# EAGLE design Scematic Kelompok 1 (EAGLE 9.6.2)
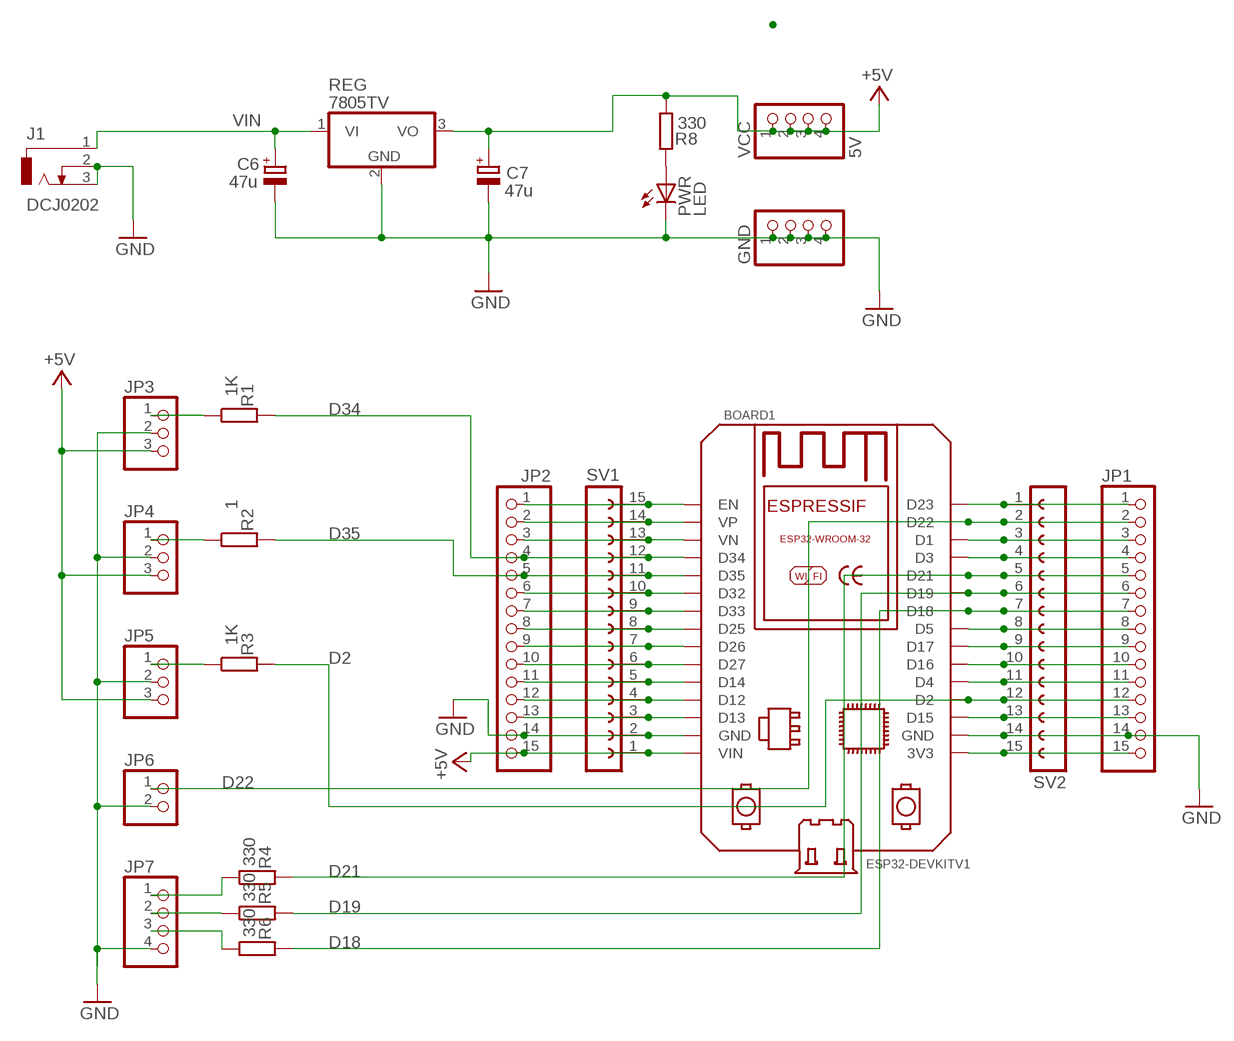
[diagram p0: schematic, sheet 1]

## Parts
BOARD1  ESP32DEVKITV1SHRIDATTDUDHAT  [ESP32-DEVKITV1]
C6  47u  CPOL-EUE2.5-5  [E2,5-5]
C7  47u  CPOL-EUE2.5-5  [E2,5-5]
GND  PINHD-1X4  [1X04]
J1  DCJ0202  [DCJ0202]
JP1  PINHD-1X15  [1X15]
JP2  PINHD-1X15  [1X15]
JP3  PINHD-1X3  [1X03]
JP4  PINHD-1X3  [1X03]
JP5  PINHD-1X3  [1X03]
JP6  PINHD-1X2  [1X02]
JP7  PINHD-1X4  [1X04]
PWR  LED  LED3MM  [LED3MM]
R1  1K  R-EU_0204/7  [0204/7]
R2  1  R-EU_0204/7  [0204/7]
R3  1K  R-EU_0204/7  [0204/7]
R4  330  R-EU_0204/7  [0204/7]
R5  330  R-EU_0204/7  [0204/7]
R6  330  R-EU_0204/7  [0204/7]
R8  330  R-EU_0204/7  [0204/7]
REG  7805TV  [TO220V]
SV1  FE15-1  [FE15]
SV2  FE15-1  [FE15]
VCC  5V  PINHD-1X4  [1X04]

## Nets
+5V [power]: BOARD1.VIN C7.+ JP2.15 JP3.3 JP4.3 JP5.3 R8.1 REG.3(VO) SV1.1 VCC.1 VCC.2 VCC.3 VCC.4
D2: BOARD1.D2 JP1.12 R3.2 SV2.12
D18: BOARD1.D18 JP1.7 R6.2 SV2.7
D19: BOARD1.D19 JP1.6 R5.2 SV2.6
D21: BOARD1.D21 JP1.5 R4.2 SV2.5
D22: BOARD1.D22 JP1.2 JP6.1 SV2.2
D34: BOARD1.D34 JP2.4 R1.2 SV1.12
D35: BOARD1.D35 JP2.5 R2.2 SV1.11
GND [power]: BOARD1.GND BOARD1.GND@1(GND) C6.- C7.- GND.1 GND.2 GND.3 GND.4 J1.2 J1.3 JP1.14 JP2.14 JP3.2 JP4.2 JP5.2 JP6.2 JP7.4 PWR.K(C) REG.2(GND) SV1.2 SV2.14
N$1: PWR.A R8.2
N$4: BOARD1.D26 JP2.9 SV1.7
N$6: BOARD1.D33 BOARD1.EN JP2.1 JP2.7 SV1.9 SV1.15
N$7: BOARD1.VP JP2.2 SV1.14
N$8: BOARD1.VN JP2.3 SV1.13
N$11: BOARD1.D32 JP2.6 SV1.10
N$12: BOARD1.D25 JP2.8 SV1.8
N$13: BOARD1.D27 JP2.10 SV1.6
N$14: BOARD1.D14 JP2.11 SV1.5
N$15: BOARD1.D12 JP2.12 SV1.4
N$16: BOARD1.D13 JP2.13 SV1.3
N$17: JP3.1 R1.1
N$18: BOARD1.D23 JP1.1 SV2.1
N$20: BOARD1.D1 JP1.3 SV2.3
N$21: BOARD1.D3 JP1.4 SV2.4
N$24: BOARD1.D5 JP1.8 SV2.8
N$25: BOARD1.D17 JP1.9 SV2.9
N$26: BOARD1.D16 JP1.10 SV2.10
N$27: BOARD1.D4 JP1.11 SV2.11
N$28: BOARD1.D15 JP1.13 SV2.13
N$29: JP4.1 R2.1
N$30: BOARD1.3V3 JP1.15 SV2.15
N$31: JP5.1 R3.1
N$32: JP7.1 R4.1
N$33: JP7.2 R5.1
N$34: JP7.3 R6.1
VIN [power]: C6.+ J1.1 REG.1(VI)

## Library data of the parts
BOARD1 = ESP32-DEVKITV1:ESP32DEVKITV1: https://github.com/shridattdudhat
C6 C7 = rcl:CPOL-EU: POLARIZED CAPACITOR, European symbol
GND JP7 VCC = pinhead:PINHD-1X4: PIN HEADER
J1 = con-jack:DCJ0202: DC POWER JACK Source: DCJ0202.pdf; OC_FARNELL: unknown; OC_NEWARK: unknown
JP1 JP2 = pinhead:PINHD-1X15: PIN HEADER
JP3-JP5 = pinhead:PINHD-1X3: PIN HEADER
JP6 = pinhead:PINHD-1X2: PIN HEADER
PWR = led:LED: LED OSRAM: - CHIPLED LG R971, LG N971, LY N971, LG Q971, LY Q971, LO R971, LY R971 LH N974, LH R974 LS Q976, LO Q976, LY Q976 LO Q996 - Hyper CHIPLED LW Q18S LB Q993, LB Q99A, LB R99A - SideLED LS A670, LO A670, LY A670, LG A670, LP A670 LB A673, LV A673, LT A673, LW A673 LH A674 LY A675 LS A676, LA A676, LO A676, LY A676, LW A676 LS A679, LY A679, LG A679 - Hyper Micro SIDELED® LS Y876, LA Y876, LO Y876, LY Y876 LT Y87S - SmartLED LW L88C, LW L88S LB L89C, LB L89S, LG L890 LS L89K, LO L89K, LY L89K LS L896, LA L896, LO L896, LY L896 - TOPLED LS T670, LO T670, LY T670, LG T670, LP T670 LSG T670, LSP T670, LSY T670, LOP T670, LYG T670 LG T671, LOG T671, LSG T671 LB T673, LV T673, LT T673, LW T673 LH T674 LS T676, LA T676, LO T676, LY T676, LB T676, LH T676, LSB T676, LW T676 LB T67C, LV T67C, LT T67C, LS T67K, LO T67K, LY T67K, LW E67C LS E67B, LA E67B, LO E67B, LY E67B, LB E67C, LV E67C, LT E67C LW T67C LS T679, LY T679, LG T679 LS T770, LO T770, LY T770, LG T770, LP T770 LB T773, LV T773, LT T773, LW T773 LH T774 LS E675, LA E675, LY E675, LS T675 LS T776, LA T776, LO T776, LY T776, LB T776 LHGB T686 LT T68C, LB T68C - Hyper Mini TOPLED® LB M676 - Mini TOPLED Santana® LG M470 LS M47K, LO M47K, LY M47K Source: http://www.osram.convergy.de/
R1-R6 R8 = rcl:R-EU_: RESISTOR, European symbol
REG = linear:78*: Positive VOLTAGE REGULATOR Source: http://cache.national.com/ds/LM/LM78L05.pdf http://www.fairchildsemi.com/ds/LM/LM7805.pdf
SV1 SV2 = con-lsta:FE15-1: FEMALE HEADER; OC_FARNELL: unknown; OC_NEWARK: unknown

## Net classes
1 power: width 0.6 mm, clearance 0.305 mm

## Board
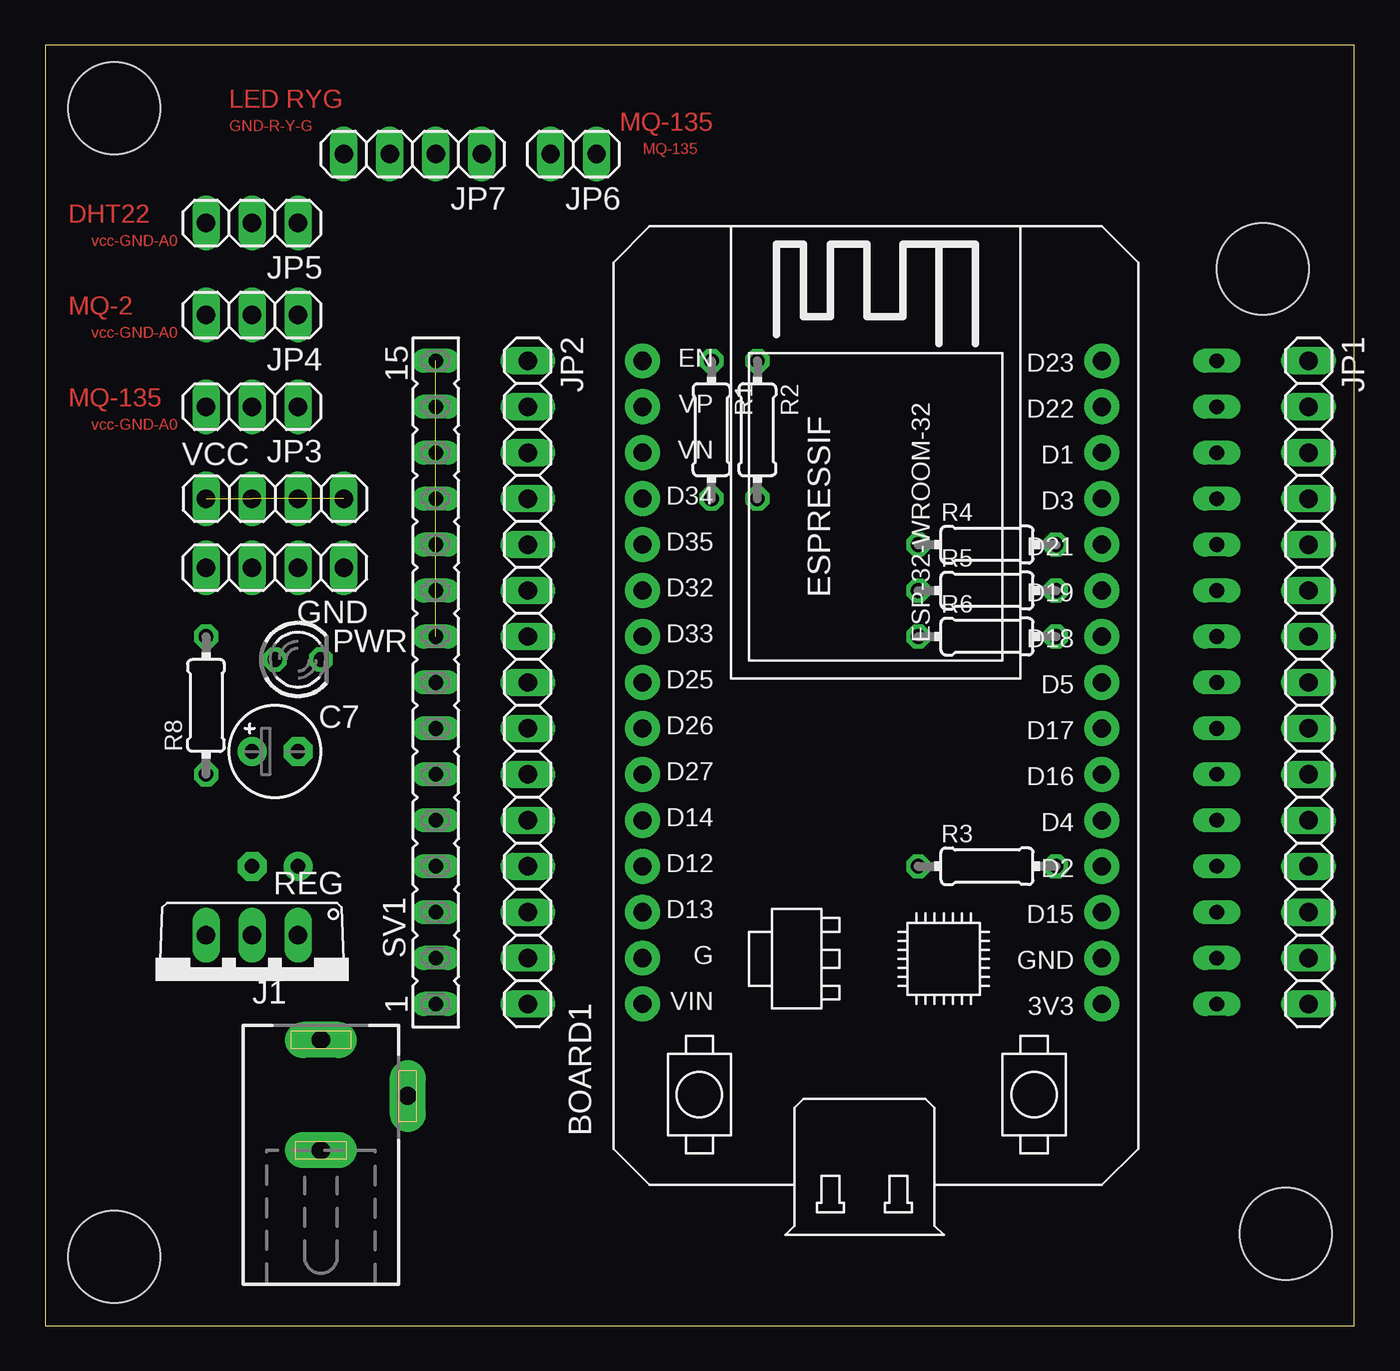
[diagram p1: board, top side]
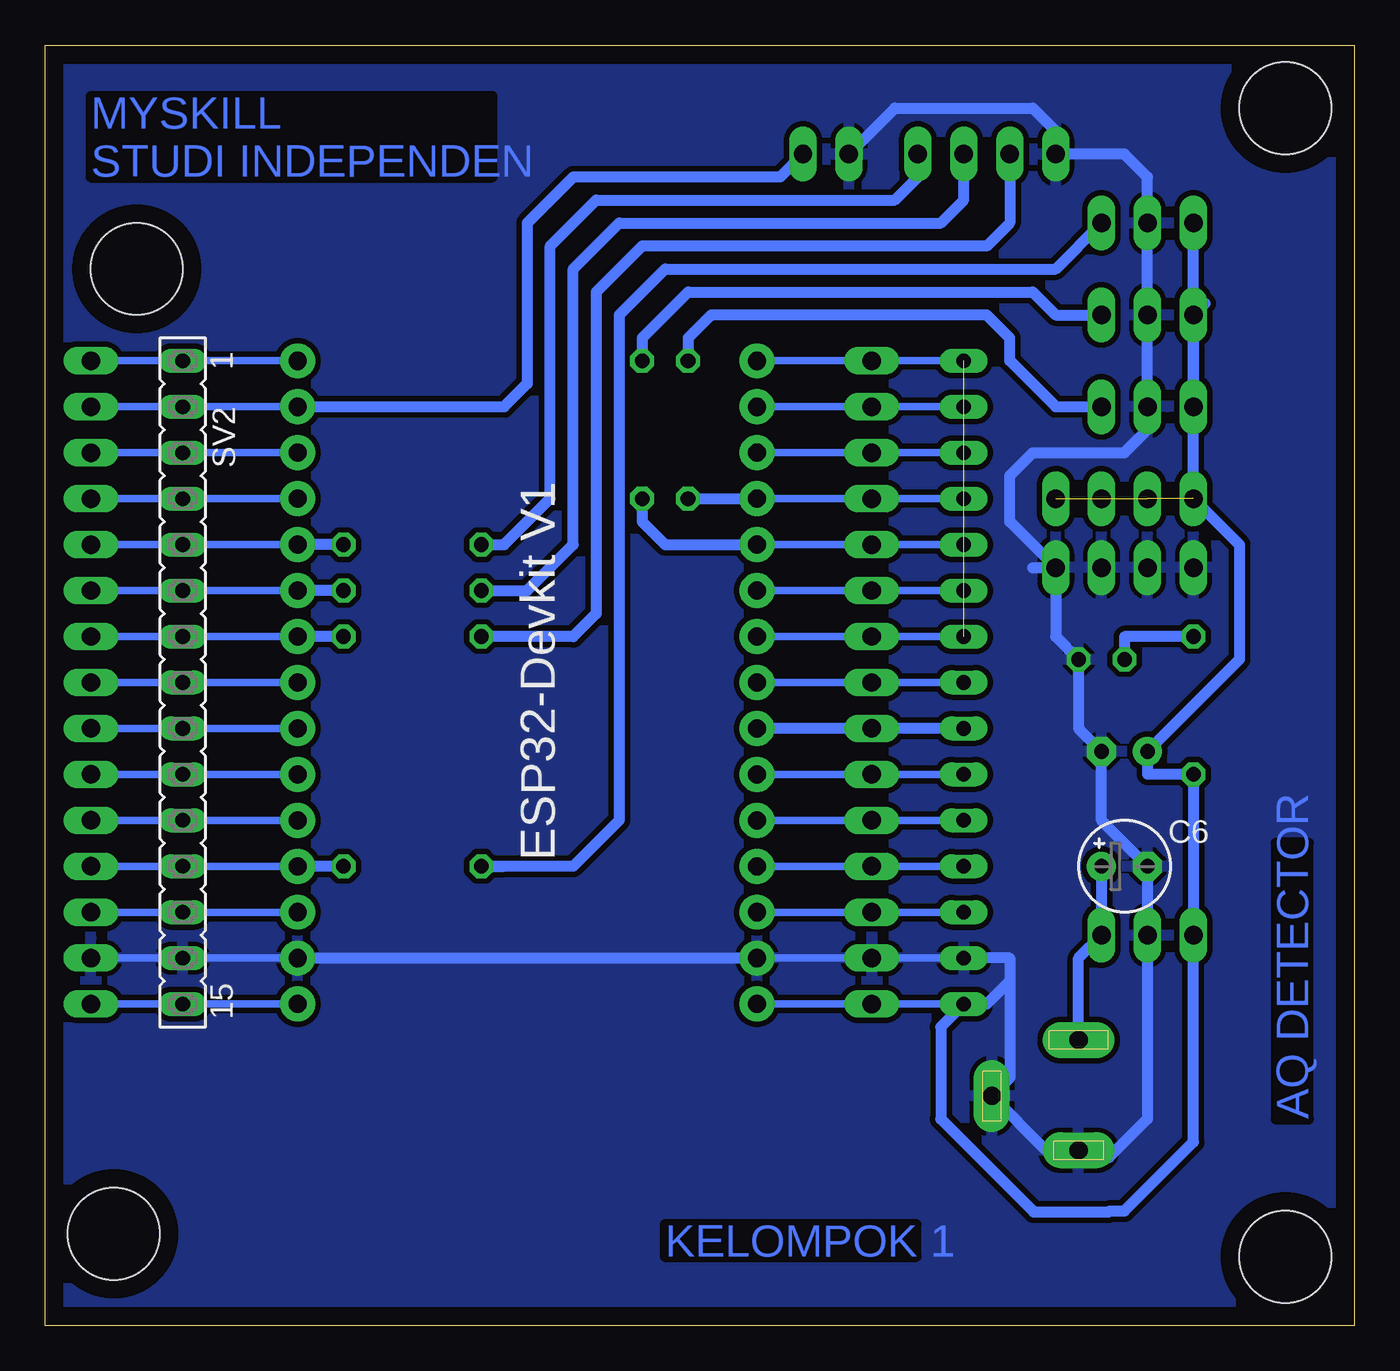
[diagram p2: board, bottom side, seen from below]

Size 72.37 x 70.79 mm. Coordinates in mm from the lower left corner, seen from the top.
Outline: 0,0 72.37,0 72.37,70.79 0,70.79 0,0
Copper layers (1*16): Top 0.035mm / dielectric 1.5mm / Bottom 0.035mm
Design rules "default": minimum track width 6mil, minimum drill 0.35mm, track to track 6mil, track to pad 6mil, pad to pad 6mil, via to via 6mil, smd to smd 6mil, copper to edge 40mil, drill to drill 6mil, minimum pad ring 10mil, minimum via ring 8mil, stop-mask expansion 4mil, vias tented up to drill 0mil, thermal gap 10mil
Holes 5.08 mm at 3.81,3.81 3.81,67.31 67.31,58.42 68.58,5.08

### Footprints (pad centres in the part's own frame; a part is rotated, then mirrored left to right if it is on the bottom)
ESP32-DEVKITV1 = drill 1 pad 1.93: 3V3 0,0; D1 30.48,0; D2 7.62,0; D3 27.94,0; D4 10.16,0; D5 17.78,0; D12 7.62,25.4; D13 5.08,25.4; D14 10.16,25.4; D15 5.08,0; D16 12.7,0; D17 15.24,0; D18 20.32,0; D19 22.86,0; D21 25.4,0; D22 33.02,0; D23 35.56,0; D25 17.78,25.4; D26 15.24,25.4; D27 12.7,25.4; D32 22.86,25.4; D33 20.32,25.4; D34 27.94,25.4; D35 25.4,25.4; EN 35.56,25.4; GND 2.54,25.4; GND@1 2.54,0; VIN 0,25.4; VN 30.48,25.4; VP 33.02,25.4
E2,5-5 = drill 0.813 pad 1.6: + -1.27,0 | drill 0.813 pad 1.6 octagon: - 1.27,0
1X04 = drill 1.016 long: 1 -3.81,0; 2 -1.27,0; 3 1.27,0; 4 3.81,0
DCJ0202 = drill 1 pad 2 long: 1 0,3.1; 2 4.8,0; 3 0,-3
1X15 = drill 1.016 long: 1 -17.78,0; 2 -15.24,0; 3 -12.7,0; 4 -10.16,0; 5 -7.62,0; 6 -5.08,0; 7 -2.54,0; 8 0,0; 9 2.54,0; 10 5.08,0; 11 7.62,0; 12 10.16,0; 13 12.7,0; 14 15.24,0; 15 17.78,0
1X03 = drill 1.016 long: 1 -2.54,0; 2 0,0; 3 2.54,0
1X02 = drill 1.016 long: 1 -1.27,0; 2 1.27,0
LED3MM = drill 0.813 octagon: A -1.27,0; K 1.27,0
0204/7 = drill 0.813 octagon: 1 -3.81,0; 2 3.81,0
TO220V = drill 1.016 long: 1 -2.54,-2.54; 2 0,-2.54; 3 2.54,-2.54
FE15 = drill 0.813 long: 1 -17.78,0; 2 -15.24,0; 3 -12.7,0; 4 -10.16,0; 5 -7.62,0; 6 -5.08,0; 7 -2.54,0; 8 0,0; 9 2.54,0; 10 5.08,0; 11 7.62,0; 12 10.16,0; 13 12.7,0; 14 15.24,0; 15 17.78,0

### Placement (x,y rotation side)
BOARD1  58.42,17.78 90 top
C6  12.7,25.4 0 bottom
C7  12.7,31.75 0 top
GND  12.7,41.91 180 top
J1  15.24,12.7 0 top
JP1  69.85,35.56 270 top
JP2  26.67,35.56 270 top
JP3  11.43,50.8 180 top
JP4  11.43,55.88 180 top
JP5  11.43,60.96 180 top
JP6  29.21,64.77 180 top
JP7  20.32,64.77 180 top
PWR  13.97,36.83 0 top
R1  36.83,49.53 270 top
R2  39.37,49.53 270 top
R3  52.07,25.4 0 top
R4  52.07,43.18 0 top
R5  52.07,40.64 0 top
R6  52.07,38.1 0 top
R8  8.89,34.29 90 top
REG  11.43,19.05 180 top
SV1  21.59,35.56 90 top
SV2  64.77,35.56 270 bottom
VCC  12.7,45.72 0 top

### Tracks (layer width: path | path; a pad name or v marks a point on that pad's centre or on a via)
+5V  (3 unrouted)
  Bottom 0.406: BOARD1.VIN JP2.15 SV1.1
  Bottom 0.6: SV1.1 22.86,16.51 22.86,11.43 17.73,6.29 13.57,6.29 13.52,6.35 12.7,6.35 8.89,10.16 REG.3 R8.1 11.43,30.48 C7.+ 6.35,36.83 6.35,43.18 VCC.1 JP4.3 | JP5.3 8.89,57.15 8.25,56.52 JP4.3 | JP4.3 JP3.3
D2
  Bottom 0.406: BOARD1.D2 SV2.12 JP1.12
  Bottom 0.6: R3.2 BOARD1.D2
D18
  Bottom 0.406: BOARD1.D18 SV2.7 JP1.7
  Bottom 0.6: R6.2 BOARD1.D18
D19
  Bottom 0.406: BOARD1.D19 SV2.6 JP1.6
  Bottom 0.6: R5.2 BOARD1.D19
D21
  Bottom 0.406: BOARD1.D21 SV2.5 JP1.5
  Bottom 0.6: R4.2 BOARD1.D21
D22
  Bottom 0.406: BOARD1.D22 SV2.2 JP1.2
  Bottom 0.6: BOARD1.D22 46.99,50.8 45.72,52.07 45.72,60.96 43.18,63.5 31.75,63.5 JP6.1
D34
  Bottom 0.406: BOARD1.D34 JP2.4 | 25.4,45.72 JP2.4 | SV1.12 JP2.4
  Bottom 0.6: R1.2 BOARD1.D34
D35
  Bottom 0.406: BOARD1.D35 JP2.5 SV1.11
  Bottom 0.6: R2.2 39.37,44.45 38.1,43.18 BOARD1.D35
GND
  Bottom 0.406: BOARD1.GND@1 SV2.14 JP1.14 | SV1.2 JP2.14 BOARD1.GND
  Bottom 0.6: REG.2 11.77,21.25 | 20.32,17.78 19.05,19.05 | 19.05,19.05 19.05,20.32 SV1.2 | BOARD1.GND@1 BOARD1.GND | REG.2 C6.- 13.97,27.94 C7.- 15.24,33.02 PWR.K 16.51,38.1 GND.1 | 17.78,41.91 GND.1 | GND.1 19.05,44.45 19.05,46.99 17.78,48.26 12.7,48.26 11.43,49.53 JP3.2 JP4.2 JP5.2 11.43,63.5 12.7,64.77 JP7.4 16.51,66.04 17.78,67.31 25.4,67.31 JP6.2 | J1.3 15.64,9.29 | REG.2 11.43,11.43 13.56,9.29 14.84,9.29 J1.3 | J1.3 17.04,9.7 J1.2 19.05,13.69 19.05,19.05
  pour Bottom: 0,71.12 72.39,71.12 72.39,0 0,0
N$1
  Bottom 0.6: R8.2 12.7,38.1 PWR.A
N$4
  Bottom 0.6: SV1.7 JP2.9 BOARD1.D26
N$6  (1 unrouted)
  Bottom 0.406: BOARD1.EN JP2.1 SV1.15 | BOARD1.D33 JP2.7 SV1.9
N$7
  Bottom 0.406: BOARD1.VP JP2.2 SV1.14
N$8
  Bottom 0.406: BOARD1.VN JP2.3 SV1.13
N$11
  Bottom 0.406: SV1.10 JP2.6 BOARD1.D32
N$12
  Bottom 0.406: SV1.8 JP2.8 BOARD1.D25
N$13
  Bottom 0.406: SV1.6 JP2.10 BOARD1.D27
N$14
  Bottom 0.406: BOARD1.D14 JP2.11 SV1.5
N$15
  Bottom 0.406: BOARD1.D12 JP2.12 SV1.4
N$16
  Bottom 0.406: BOARD1.D13 JP2.13 SV1.3
N$17
  Bottom 0.6: JP3.1 16.51,50.8 19.05,53.34 19.05,54.61 20.32,55.88 35.56,55.88 36.83,54.61 R1.1
N$18
  Bottom 0.406: BOARD1.D23 SV2.1 JP1.1
N$20
  Bottom 0.406: BOARD1.D1 SV2.3 JP1.3
N$21
  Bottom 0.406: BOARD1.D3 SV2.4 JP1.4
N$24
  Bottom 0.406: BOARD1.D5 SV2.8 JP1.8
N$25
  Bottom 0.406: BOARD1.D17 SV2.9 JP1.9
N$26
  Bottom 0.406: BOARD1.D16 SV2.10 JP1.10
N$27
  Bottom 0.406: BOARD1.D4 SV2.11 JP1.11
N$28
  Bottom 0.406: BOARD1.D15 SV2.13 JP1.13
N$29
  Bottom 0.6: JP4.1 16.51,55.88 17.78,57.15 36.83,57.15 39.37,54.61 R2.1
N$30
  Bottom 0.406: BOARD1.3V3 SV2.15 JP1.15
N$31
  Bottom 0.6: 46.99,25.4 R3.1 43.18,25.4 40.64,27.94 40.64,55.88 38.1,58.42 16.51,58.42 JP5.1
N$32
  Bottom 0.6: R4.1 46.99,43.18 44.45,45.72 44.45,59.69 41.91,62.23 25.4,62.23 24.13,63.5 JP7.1
N$33
  Bottom 0.6: R5.1 45.72,40.64 43.18,43.18 43.18,58.42 40.64,60.96 22.86,60.96 21.59,62.23 JP7.2
N$34
  Bottom 0.6: JP7.3 19.05,60.96 20.32,59.69 39.37,59.69 41.91,57.15 41.91,39.37 43.18,38.1 R6.1
VIN
  Bottom 0.6: J1.1 15.24,20.32 REG.1 C6.+

### Text on the board
Top: LED RYG | GND-R-Y-G | MQ-135 | MQ-135 | DHT22 | vcc-GND-A0 | MQ-2 | vcc-GND-A0 | MQ-135 | vcc-GND-A0
Bottom: MYSKILL / STUDI INDEPENDEN | AQ DETECTOR | KELOMPOK 1